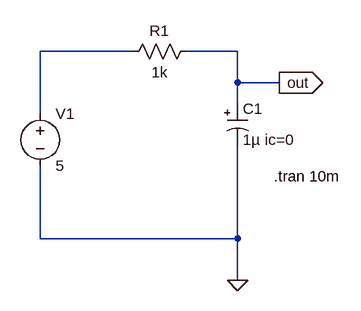
[diagram p0: schematic Condensador y gráfica.asc]
Condensador y gráfica.asc, the LTspice schematic file:
Version 4
SHEET 1 880 680
WIRE 224 48 80 48
WIRE 384 48 304 48
WIRE 384 96 384 48
WIRE 448 96 384 96
WIRE 384 128 384 96
WIRE 80 144 80 48
WIRE 80 336 80 224
WIRE 384 336 384 192
WIRE 384 336 80 336
WIRE 384 400 384 336
FLAG 384 400 0
FLAG 448 96 out
IOPIN 448 96 Out
SYMBOL voltage 80 128 R0
WINDOW 123 0 0 Left 0
WINDOW 39 0 0 Left 0
SYMATTR InstName V1
SYMATTR Value 5
SYMBOL res 208 64 R270
WINDOW 0 32 56 VTop 2
WINDOW 3 0 56 VBottom 2
SYMATTR InstName R1
SYMATTR Value 1k
SYMBOL polcap 368 128 R0
WINDOW 3 24 56 Left 2
SYMATTR InstName C1
SYMATTR Value 1µ ic=0
SYMATTR Description Capacitor
SYMATTR Type cap
SYMATTR SpiceLine V=0 Irms=0 Rser=0 Lser=0
TEXT 440 240 Left 2 !.tran 10m

The netlist it stands for:
* Condensador y gráfica.asc
V1 N001 0 5
R1 N001 out 1k
C1 out 0 1µ ic=0 V=0 Irms=0 Rser=0 Lser=0
.tran 10m
.backanno
.end

* Results of the author's LTspice run, read from the files saved beside the schematic
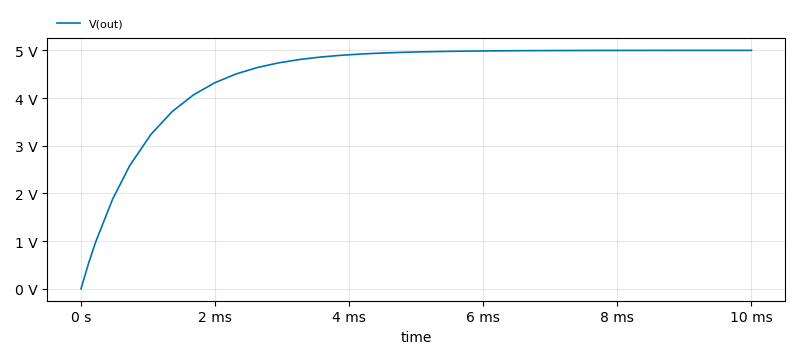
[diagram p1: Transient Analysis of Condensador y gráfica.asc, plotted from the saved traces]
* Transient Analysis, 1 run:
*   V(out): min 5 µV, max 5 V, average 4.497 V, rms 4.609 V, last 5 V